# Altium schematic sheet TopLevel.SchDoc
size A4; SheetNumber: 1; SheetTotal: 13
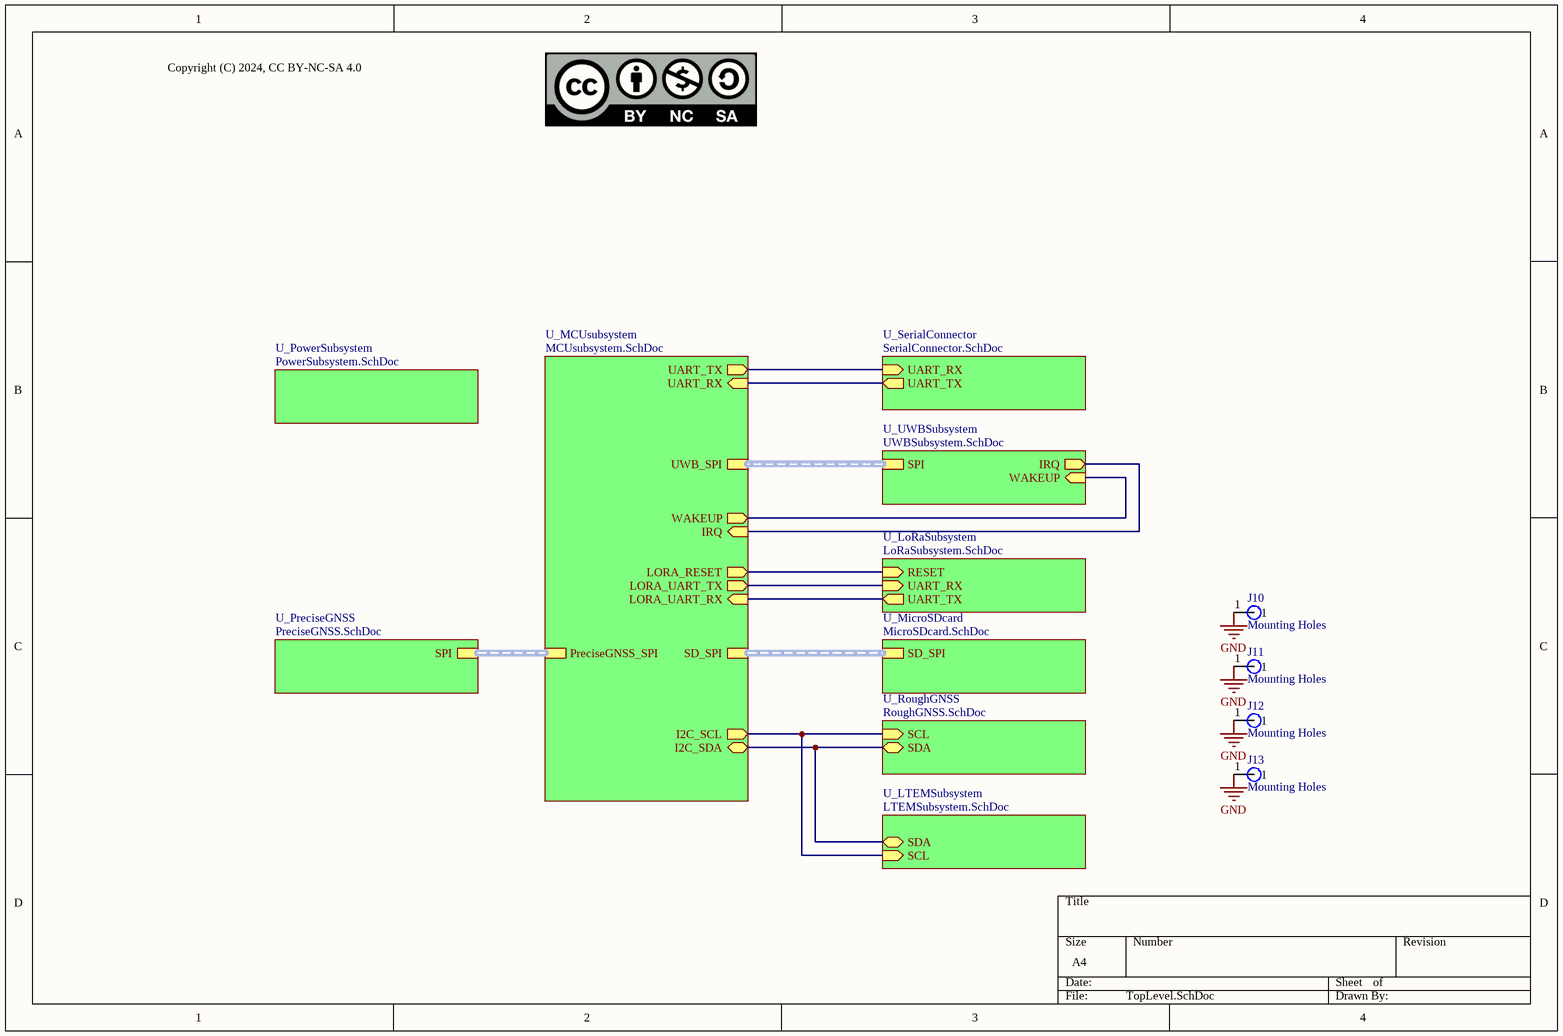
[diagram p0: TopLevel.SchDoc]

## Parts
J10  Mounting Holes  [Mounting Hole]
J11  Mounting Holes  [Mounting Hole]
J12  Mounting Holes  [Mounting Hole]
J13  Mounting Holes  [Mounting Hole]

## Sub-sheets
U_LoRaSubsystem = LoRaSubsystem.SchDoc: UART_RX (in), UART_TX (out), RESET (in)
U_LTEMSubsystem = LTEMSubsystem.SchDoc: SDA (bidir), SCL (in)
U_MCUsubsystem = MCUsubsystem.SchDoc: UART_RX (in), UART_TX (out), UWB_SPI (harness SPI), LORA_UART_TX (out), LORA_UART_RX (in), PreciseGNSS_SPI (harness SPI), SD_SPI (harness SPI), LORA_RESET (out), I2C_SDA (bidir), I2C_SCL (out), WAKEUP (out), IRQ (in)
U_MicroSDcard = MicroSDcard.SchDoc: SD_SPI (harness SPI)
U_PowerSubsystem = PowerSubsystem.SchDoc: no entries
U_PreciseGNSS = PreciseGNSS.SchDoc: SPI (harness SPI)
U_RoughGNSS = RoughGNSS.SchDoc: SCL (in), SDA (bidir)
U_SerialConnector = SerialConnector.SchDoc: UART_RX (in), UART_TX (out)
U_UWBSubsystem = UWBSubsystem.SchDoc: SPI (harness SPI), IRQ (out), WAKEUP (in)

## Nets
GND: J10.1 J11.1 J12.1 J13.1
(unnamed): sheet U_MCUsubsystem/UART_RX, sheet U_SerialConnector/UART_TX
(unnamed): sheet U_MCUsubsystem/UART_TX, sheet U_SerialConnector/UART_RX
(unnamed): sheet U_MCUsubsystem/LORA_UART_TX, sheet U_LoRaSubsystem/UART_RX
(unnamed): sheet U_MCUsubsystem/LORA_UART_RX, sheet U_LoRaSubsystem/UART_TX
(unnamed): sheet U_MCUsubsystem/LORA_RESET, sheet U_LoRaSubsystem/RESET
(unnamed): sheet U_MCUsubsystem/I2C_SDA, sheet U_LTEMSubsystem/SDA, sheet U_RoughGNSS/SDA
(unnamed): sheet U_MCUsubsystem/I2C_SCL, sheet U_LTEMSubsystem/SCL, sheet U_RoughGNSS/SCL
(unnamed): sheet U_MCUsubsystem/WAKEUP, sheet U_UWBSubsystem/WAKEUP
(unnamed): sheet U_MCUsubsystem/IRQ, sheet U_UWBSubsystem/IRQ

## Buses and harness runs
harness sheet U_MCUsubsystem/PreciseGNSS_SPI = sheet U_PreciseGNSS/SPI
harness sheet U_MCUsubsystem/SD_SPI = sheet U_MicroSDcard/SD_SPI
harness sheet U_MCUsubsystem/UWB_SPI = sheet U_UWBSubsystem/SPI

## Notes on the sheet
- Copyright (C) 2024, CC BY-NC-SA 4.0